# EAGLE design motorboard (EAGLE 6.6.0)

## Sheet 1 of 3
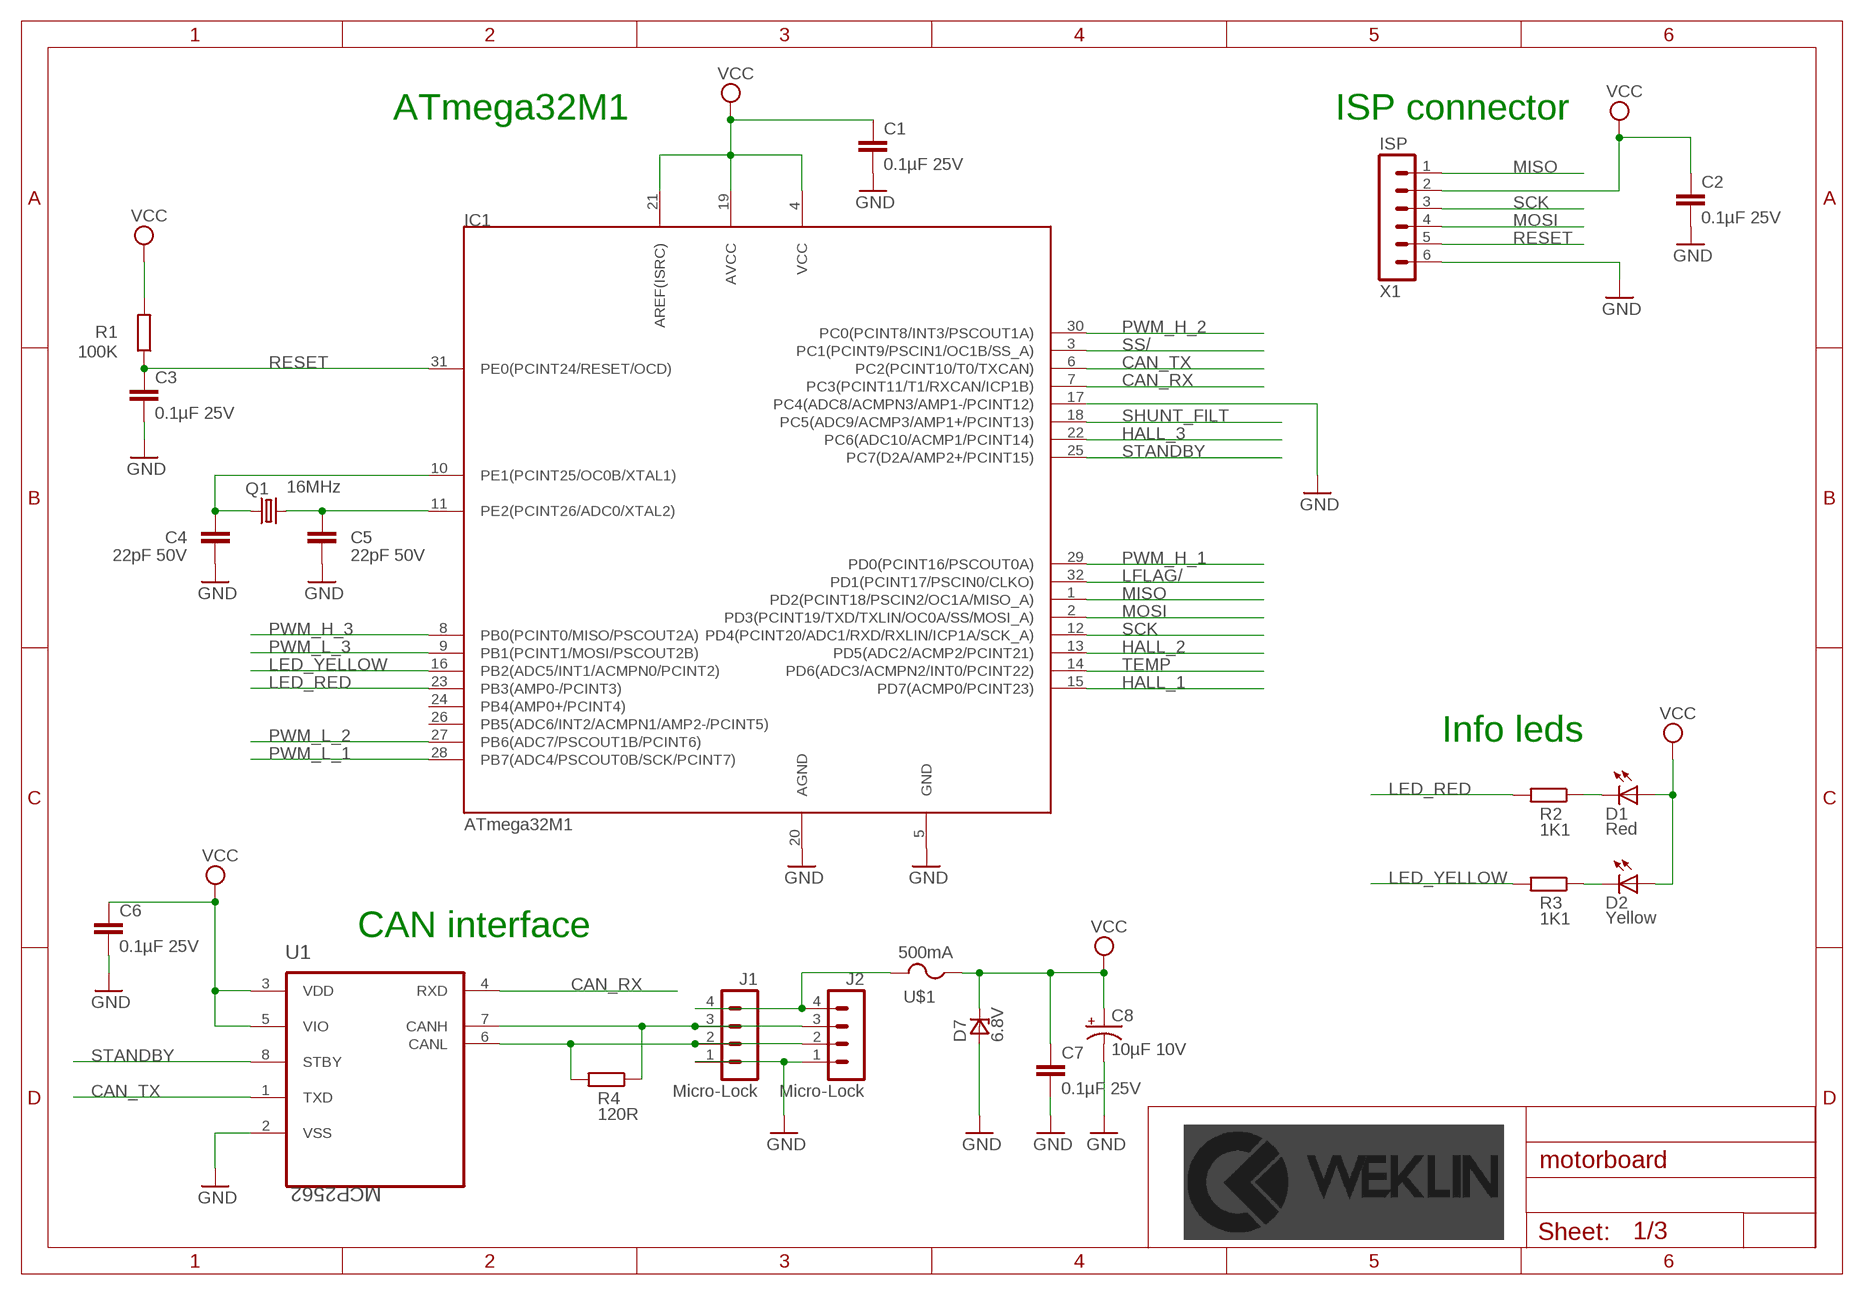
[diagram p0: schematic, sheet 1]

### Parts
C1  0.1µF 25V  CAPACITOR_NON_POL-0.1µF-25V(+-10%)(2012)  [C2012]
C2  0.1µF 25V  CAPACITOR_NON_POL-0.1µF-25V(+-10%)(2012)  [C2012]
C3  0.1µF 25V  CAPACITOR_NON_POL-0.1µF-25V(+-10%)(2012)  [C2012]
C4  22pF 50V  CAPACITOR_NON_POL-22PF-50V(+-5%)(2012)  [C2012]
C5  22pF 50V  CAPACITOR_NON_POL-22PF-50V(+-5%)(2012)  [C2012]
C6  0.1µF 25V  CAPACITOR_NON_POL-0.1µF-25V(+-10%)(2012)  [C2012]
C7  0.1µF 25V  CAPACITOR_NON_POL-0.1µF-25V(+-10%)(2012)  [C2012]
C8  10µF 10V  CAPACITOR_POL-10µF-10V(+-10%)(3216)  [EIA3216]
D1  Red  LEDVLDS1235G  [VLD]
D2  Yellow  LED-VLDY1235G  [VLD]
D7  6.8V  ZENER_UNIDIR6.8  [DO-214AA]
IC1  ATmega32M1  ATMEGA32M1-TQFP32  [TQFP32]
J1  Micro-Lock  MICROLOCK-4CMS  [504195-0470]
J2  Micro-Lock  MICROLOCK-4CMS  [504195-0470]
Q1  16MHz  CRYSTAL-16MHZ_SMD(3225)  [SMD_KX7]
R1  100K  RESISTOR-100K(+-1%)(2012)  [R2012]
R2  1K1  RESISTOR-1K1(+-1%)(2012)  [R2012]
R3  1K1  RESISTOR-1K1(+-1%)(2012)  [R2012]
R4  120R  RESISTOR-120R(+-1%)(2012)  [R2012]
U1  MCP2562  MCP2562-E/SN-SOIC8  [SOIC8]
U$1  500mA  FUSE  [EIARS-481-2]
X1  ISP  MINITEK_127_6WAYS-SMD  [MINITEK_127_6WAY_SMD]

### Nets
CAN_RX: IC1.7(PC3(PCINT11/T1/RXCAN/ICP1B)) U1.4(RXD)
CAN_TX: IC1.6(PC2(PCINT10/T0/TXCAN)) U1.1(TXD)
GND: C1.2 C2.2 C3.2 C4.2 C5.2 C6.2 C7.2 C8.C(-) D7.A IC1.5(GND) IC1.17(PC4(ADC8/ACMPN3/AMP1-/PCINT12)) IC1.20(AGND) J1.1 J2.1 U1.2(VSS) X1.6 ; also sheet 2,3
HALL_1: IC1.15(PD7(ACMP0/PCINT23)) ; also sheet 2
HALL_2: IC1.13(PD5(ADC2/ACMP2/PCINT21)) ; also sheet 2
HALL_3: IC1.22(PC6(ADC10/ACMP1/PCINT14)) ; also sheet 2
LED_RED: IC1.23(PB3(AMP0-/PCINT3)) R2.2
LED_YELLOW: IC1.16(PB2(ADC5/INT1/ACMPN0/PCINT2)) R3.2
LFLAG/: IC1.32(PD1(PCINT17/PSCIN0/CLKO)) ; also sheet 2
MISO: IC1.1(PD2(PCINT18/PSCIN2/OC1A/MISO_A)) X1.1 ; also sheet 2
MOSI: IC1.2(PD3(PCINT19/TXD/TXLIN/OC0A/SS/MOSI_A)) X1.4 ; also sheet 2
N$2: D1.C R2.1
N$3: D2.C R3.1
N$4: J1.4 J2.4 U$1.2
N$5: J1.2 J2.2 R4.2 U1.6(CANL)
N$6: J1.3 J2.3 R4.1 U1.7(CANH)
N$7: C5.1 IC1.11(PE2(PCINT26/ADC0/XTAL2)) Q1.3
N$9: C4.1 IC1.10(PE1(PCINT25/OC0B/XTAL1)) Q1.1
PWM_H_1: IC1.29(PD0(PCINT16/PSCOUT0A)) ; also sheet 3
PWM_H_2: IC1.30(PC0(PCINT8/INT3/PSCOUT1A)) ; also sheet 3
PWM_H_3: IC1.8(PB0(PCINT0/MISO/PSCOUT2A)) ; also sheet 3
PWM_L_1: IC1.28(PB7(ADC4/PSCOUT0B/SCK/PCINT7)) ; also sheet 3
PWM_L_2: IC1.27(PB6(ADC7/PSCOUT1B/PCINT6)) ; also sheet 3
PWM_L_3: IC1.9(PB1(PCINT1/MOSI/PSCOUT2B)) ; also sheet 3
RESET: C3.1 IC1.31(PE0(PCINT24/RESET/OCD)) R1.1 X1.5
SCK: IC1.12(PD4(PCINT20/ADC1/RXD/RXLIN/ICP1A/SCK_A)) X1.3 ; also sheet 2
SHUNT_FILT: IC1.18(PC5(ADC9/ACMP3/AMP1+/PCINT13)) ; also sheet 2
SS/: IC1.3(PC1(PCINT9/PSCIN1/OC1B/SS_A)) ; also sheet 2
STANDBY: IC1.25(PC7(D2A/AMP2+/PCINT15)) U1.8(STBY) ; also sheet 2
TEMP: IC1.14(PD6(ADC3/ACMPN2/INT0/PCINT22)) ; also sheet 2
VCC: C1.1 C2.1 C6.1 C7.1 C8.A(+) D1.A D2.A D7.C IC1.4(VCC) IC1.19(AVCC) IC1.21(AREF(ISRC)) R1.2 U1.3(VDD) U1.5(VIO) U$1.1 X1.2 ; also sheet 2
Unconnected: IC1.24(PB4(AMP0+/PCINT4)) IC1.26(PB5(ADC6/INT2/ACMPN1/AMP2-/PCINT5))

### Notes on the sheet
- ATmega32M1 | ISP connector
- Info leds
- CAN interface

## Sheet 2 of 3
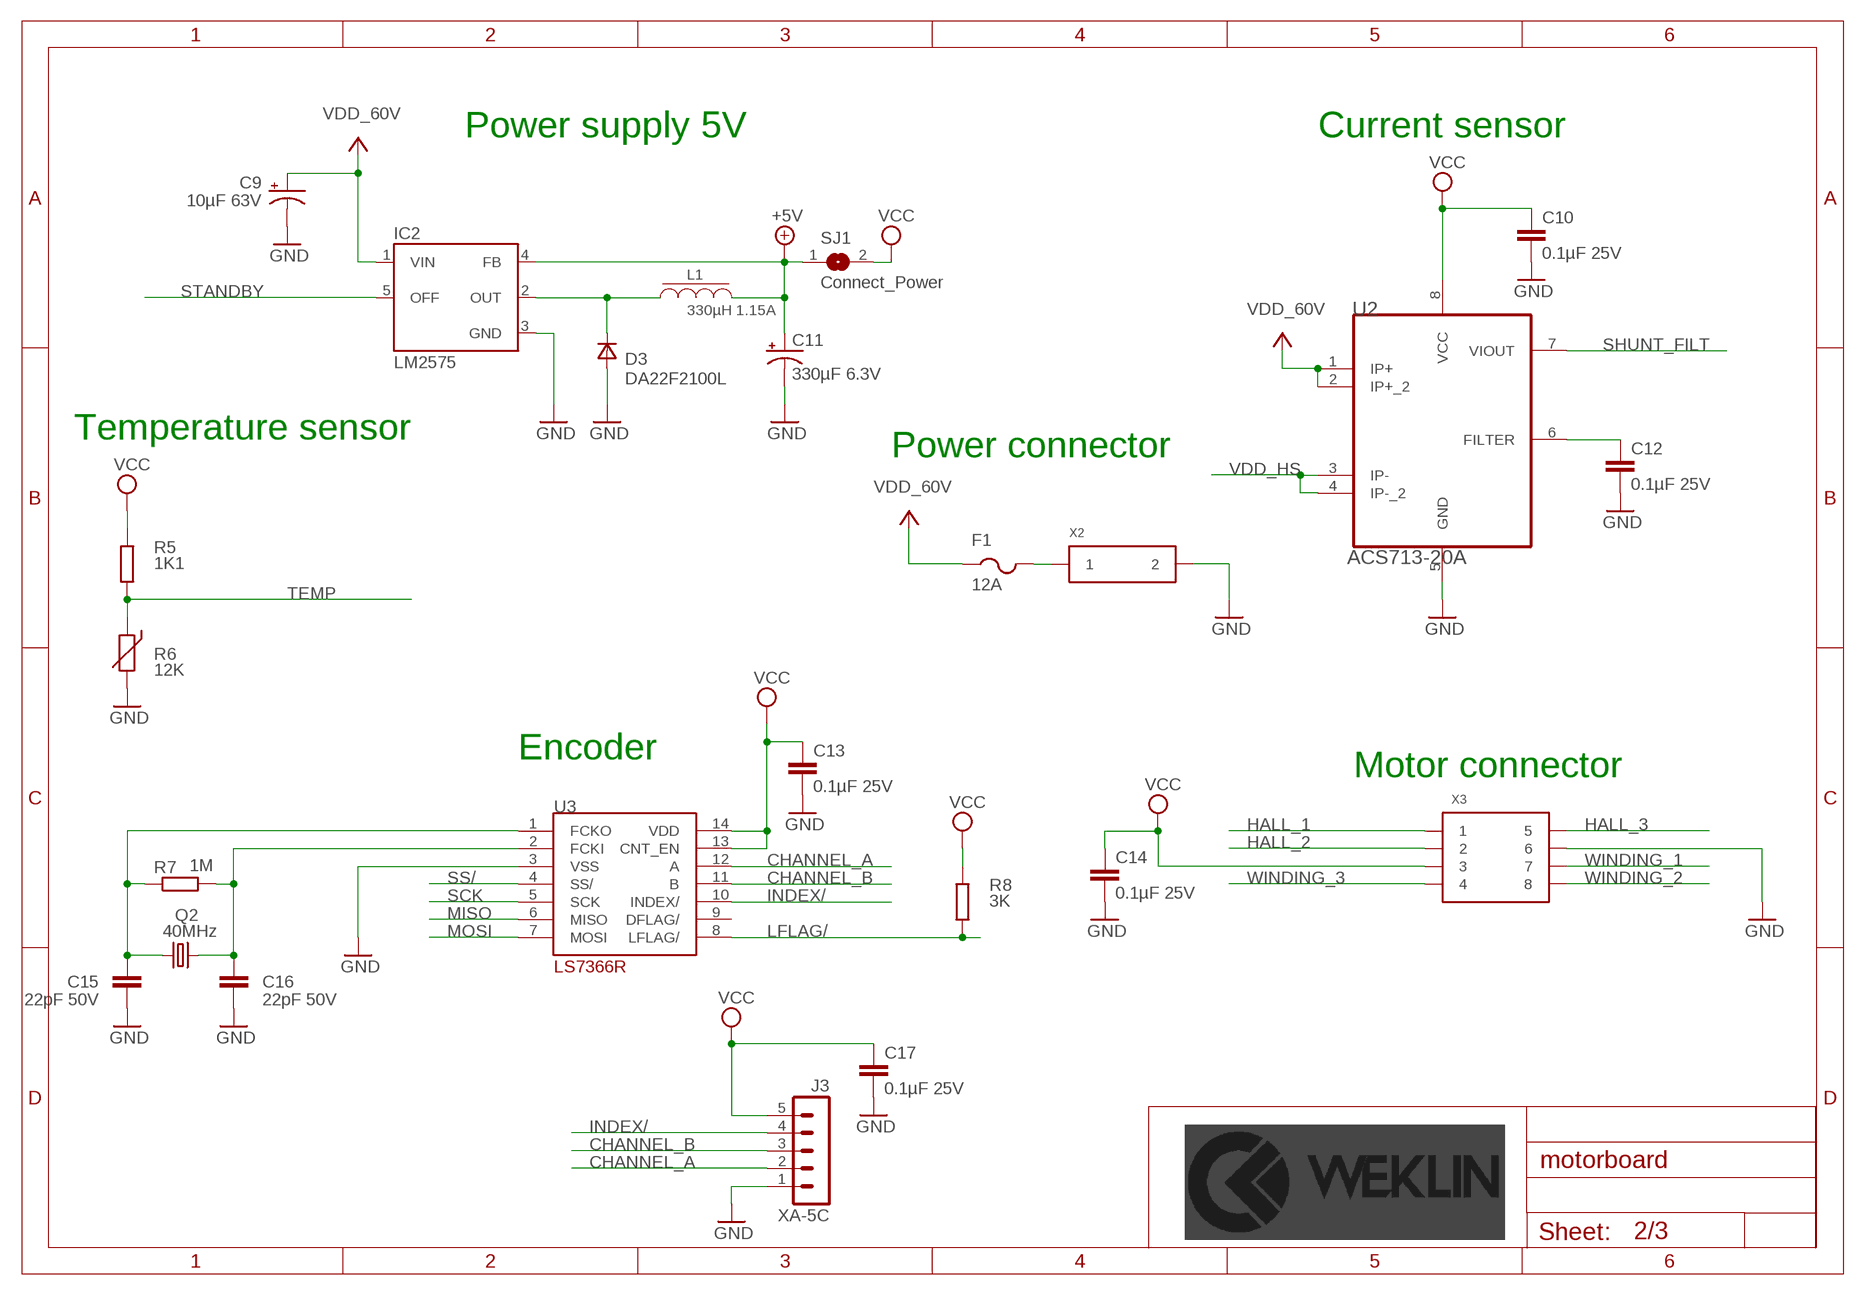
[diagram p1: schematic, sheet 2]

### Parts
C9  10µF 63V  CAPACITOR_POL-100µF-63V(+-10%)(1010)  [153CLV-1010]
C10  0.1µF 25V  CAPACITOR_NON_POL-0.1µF-25V(+-10%)(2012)  [C2012]
C11  330µF 6.3V  CAPACITOR_POL-330µF-6.3V(+-10%)(7343)  [EIA7343]
C12  0.1µF 25V  CAPACITOR_NON_POL-0.1µF-25V(+-10%)(2012)  [C2012]
C13  0.1µF 25V  CAPACITOR_NON_POL-0.1µF-25V(+-10%)(2012)  [C2012]
C14  0.1µF 25V  CAPACITOR_NON_POL-0.1µF-25V(+-10%)(2012)  [C2012]
C15  22pF 50V  CAPACITOR_NON_POL-22PF-50V(+-5%)(2012)  [C2012]
C16  22pF 50V  CAPACITOR_NON_POL-22PF-50V(+-5%)(2012)  [C2012]
C17  0.1µF 25V  CAPACITOR_NON_POL-0.1µF-25V(+-10%)(2012)  [C2012]
D3  DA22F2100L  DIODE-DA22F2100L  [SOD323]
F1  12A  PTCFUSE-3216(1206)  [R3216]
IC2  LM2575  LM2575-TO263  [TO263-5]
J3  XA-5C  XA-5-RIGHT_ANGLE  [S05B-XASK-1]
L1  330µH 1.15A  SRR1260A-331K  [DRA124]
Q2  40MHz  CRYSTAL-40MHZ_SMD(3225)  [SMD_KX7]
R5  1K1  RESISTOR-1K1(+-1%)(2012)  [R2012]
R6  12K  NB12L00123KBB-2012(0805)  [T2012]
R7  1M  RESISTOR-1M(+-1%)(2012)  [R2012]
R8  3K  RESISTOR-3K(+-1%)(2012)  [R2012]
SJ1  Connect_Power  JUMPER_PCB  [SJ]
U2  ACS713-20A  ASC713713ELCTR-20A-T  [SOIC8]
U3  LS7366R  LS7366R-TS-TSSOP14  [TSSOP14]
X2  Mini-Fit  MINI-FIT-JR-025569-NA1  [5569-02]
X3  Mini-Fit  MINI-FIT-JR-085569-NA1  [5569-08]

### Nets
+5V: C11.A(+) IC2.4(FB) L1.2 SJ1.1 ; also sheet 3
CHANNEL_A: J3.2 U3.12(A)
CHANNEL_B: J3.3 U3.11(B)
GND: C9.- C10.2 C11.C(-) C12.2 C13.2 C14.2 C15.2 C16.2 C17.2 D3.2(A) IC2.3(GND) J3.1 R6.2 U2.5(GND) U3.3(VSS) X2.P2 X3.P6 ; also sheet 1,3
HALL_1: X3.P1 ; also sheet 1
HALL_2: X3.P2 ; also sheet 1
HALL_3: X3.P5 ; also sheet 1
INDEX/: J3.4 U3.10(INDEX/)
LFLAG/: R8.2 U3.8(LFLAG/) ; also sheet 1
MISO: U3.6(MISO) ; also sheet 1
MOSI: U3.7(MOSI) ; also sheet 1
N$1: D3.1(C) IC2.2(OUT) L1.1
N$11: C16.1 Q2.3 R7.2 U3.2(FCKI)
N$14: C15.1 Q2.1 R7.1 U3.1(FCKO)
N$15: F1.2 X2.P1
N$16: C12.1 U2.6(FILTER)
SCK: U3.5(SCK) ; also sheet 1
SHUNT_FILT: U2.7(VIOUT) ; also sheet 1
SS/: U3.4(SS/) ; also sheet 1
STANDBY: IC2.5(OFF) ; also sheet 1
TEMP: R5.1 R6.1 ; also sheet 1
VCC: C10.1 C13.1 C14.1 C17.1 J3.5 R5.2 R8.1 SJ1.2 U2.8(VCC) U3.13(CNT_EN) U3.14(VDD) X3.P3 ; also sheet 1
VDD: C9.+ F1.1 IC2.1(VIN) U2.1(IP+) U2.2(IP+_2) ; supply symbol labelled VDD_60V
VDD_HS: U2.3(IP-) U2.4(IP-_2) ; also sheet 3
WINDING_1: X3.P7 ; also sheet 3
WINDING_2: X3.P8 ; also sheet 3
WINDING_3: X3.P4 ; also sheet 3
Unconnected: U3.9(DFLAG/)

### Notes on the sheet
- Power supply 5V | Current sensor
- Temperature sensor
- Power connector
- Encoder
- Motor connector

## Sheet 3 of 3
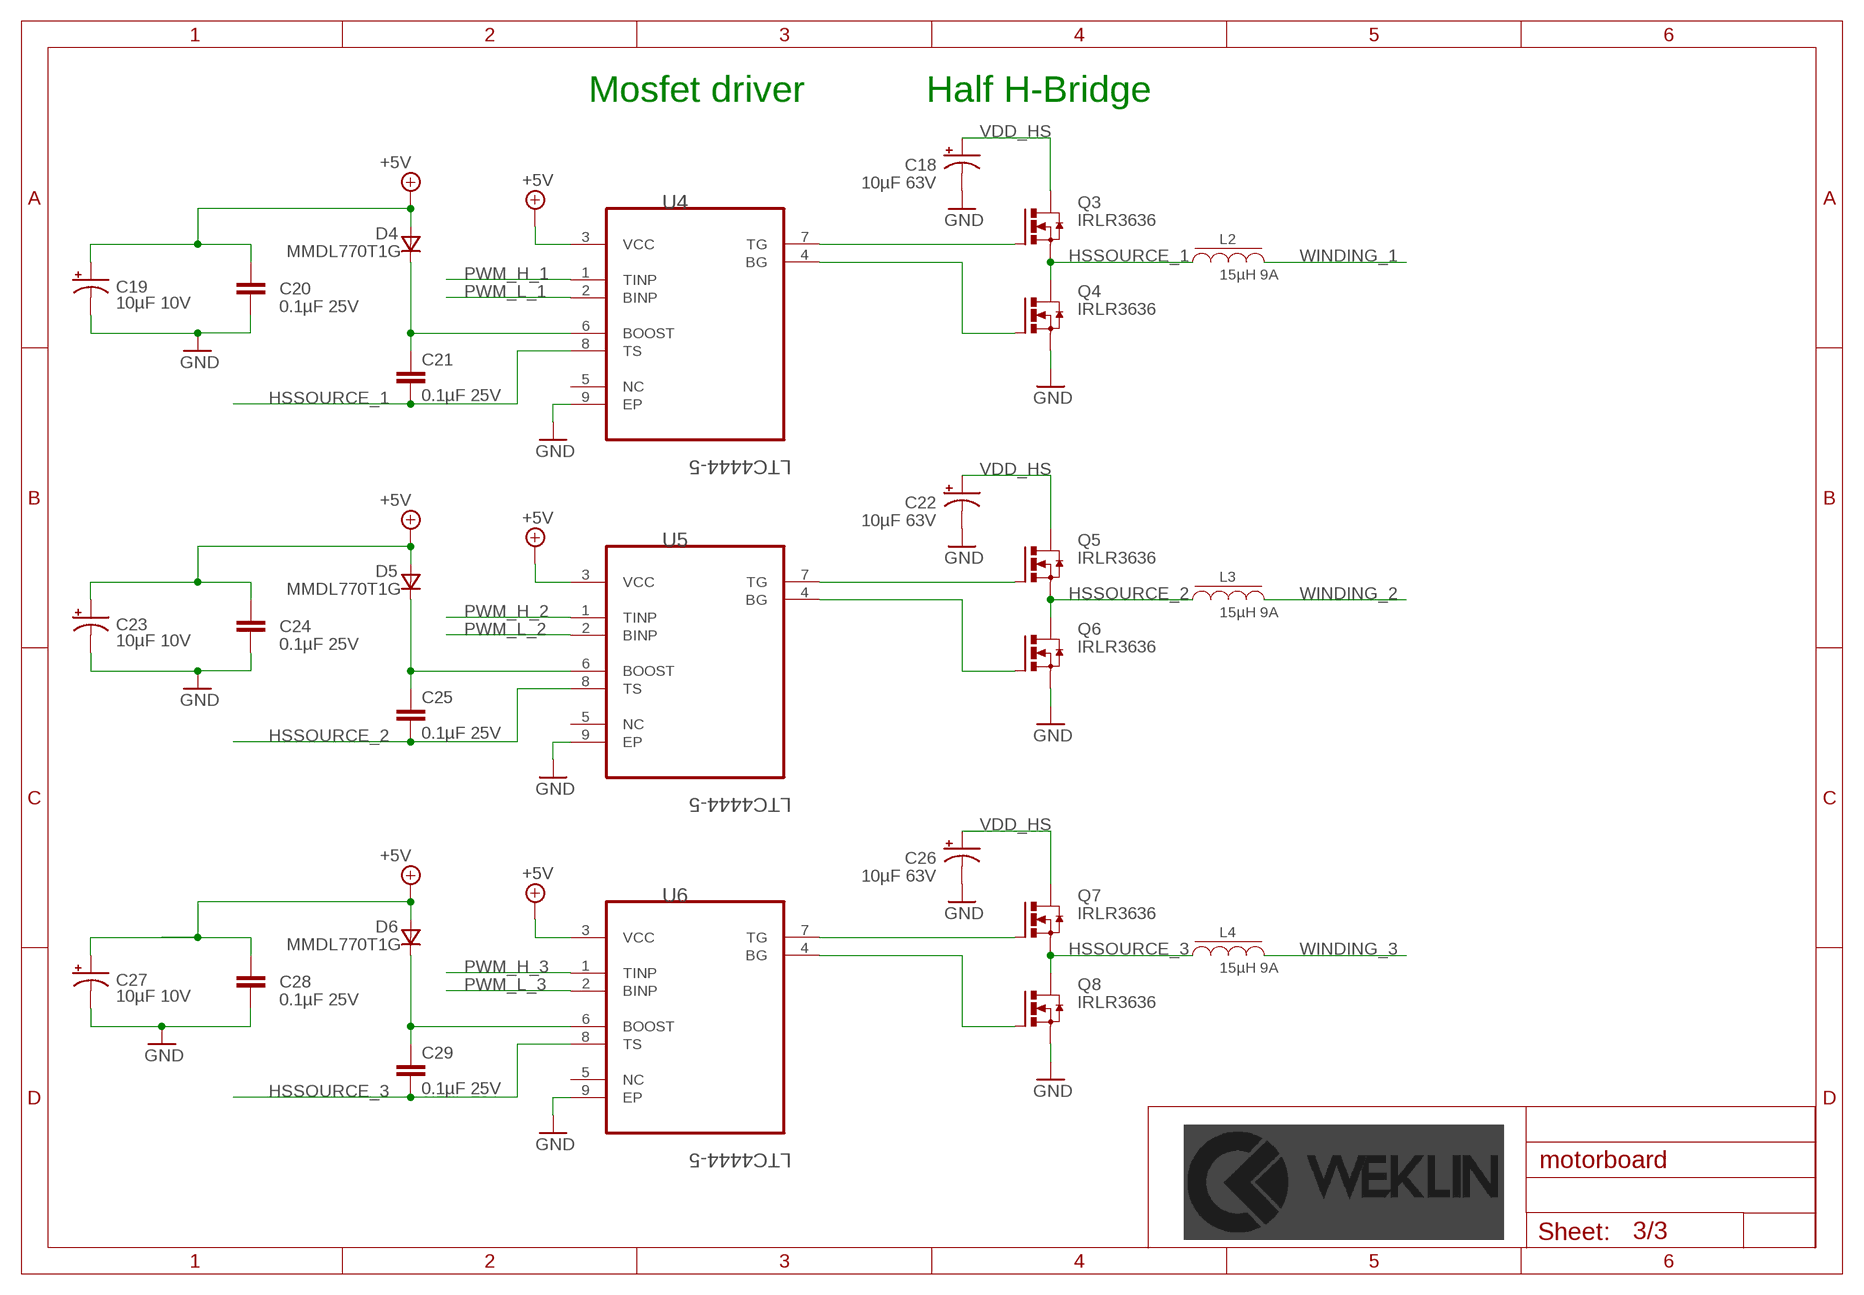
[diagram p2: schematic, sheet 3]

### Parts
C18  10µF 63V  CAPACITOR_POL-100µF-63V(+-10%)(1010)  [153CLV-1010]
C19  10µF 10V  CAPACITOR_POL-10µF-10V(+-10%)(3216)  [EIA3216]
C20  0.1µF 25V  CAPACITOR_NON_POL-0.1µF-25V(+-10%)(2012)  [C2012]
C21  0.1µF 25V  CAPACITOR_NON_POL-0.1µF-25V(+-10%)(2012)  [C2012]
C22  10µF 63V  CAPACITOR_POL-100µF-63V(+-10%)(1010)  [153CLV-1010]
C23  10µF 10V  CAPACITOR_POL-10µF-10V(+-10%)(3216)  [EIA3216]
C24  0.1µF 25V  CAPACITOR_NON_POL-0.1µF-25V(+-10%)(2012)  [C2012]
C25  0.1µF 25V  CAPACITOR_NON_POL-0.1µF-25V(+-10%)(2012)  [C2012]
C26  10µF 63V  CAPACITOR_POL-100µF-63V(+-10%)(1010)  [153CLV-1010]
C27  10µF 10V  CAPACITOR_POL-10µF-10V(+-10%)(3216)  [EIA3216]
C28  0.1µF 25V  CAPACITOR_NON_POL-0.1µF-25V(+-10%)(2012)  [C2012]
C29  0.1µF 25V  CAPACITOR_NON_POL-0.1µF-25V(+-10%)(2012)  [C2012]
D4  MMDL770T1G  DIODE-MMDL770T1G  [SOD323]
D5  MMDL770T1G  DIODE-MMDL770T1G  [SOD323]
D6  MMDL770T1G  DIODE-MMDL770T1G  [SOD323]
L2  15µH 9A  SRP1265A-150M  [DRA127]
L3  15µH 9A  SRP1265A-150M  [DRA127]
L4  15µH 9A  SRP1265A-150M  [DRA127]
Q3  IRLR3636  [TO252]
Q4  IRLR3636  [TO252]
Q5  IRLR3636  [TO252]
Q6  IRLR3636  [TO252]
Q7  IRLR3636  [TO252]
Q8  IRLR3636  [TO252]
U4  LTC4444-5  LTC4444EMS8EPBF  [MSOP8]
U5  LTC4444-5  LTC4444EMS8EPBF  [MSOP8]
U6  LTC4444-5  LTC4444EMS8EPBF  [MSOP8]

### Nets
+5V: C19.A(+) C20.1 C23.A(+) C24.1 C27.A(+) C28.1 D4.2(A) D5.2(A) D6.2(A) U4.3(VCC) U5.3(VCC) U6.3(VCC) ; also sheet 2
GND: C18.- C19.C(-) C20.2 C22.- C23.C(-) C24.2 C26.- C27.C(-) C28.2 Q4.3(S) Q6.3(S) Q8.3(S) U4.9(EP) U5.9(EP) U6.9(EP) ; also sheet 1,2
HSSOURCE_1: C21.2 L2.1 Q3.3(S) Q4.4(D) U4.8(TS)
HSSOURCE_2: C25.2 L3.1 Q5.3(S) Q6.4(D) U5.8(TS)
HSSOURCE_3: C29.2 L4.1 Q7.3(S) Q8.4(D) U6.8(TS)
N$8: C25.1 D5.1(C) U5.6(BOOST)
N$10: C21.1 D4.1(C) U4.6(BOOST)
N$12: Q4.1(G) U4.4(BG)
N$13: Q3.1(G) U4.7(TG)
N$17: Q6.1(G) U5.4(BG)
N$18: Q5.1(G) U5.7(TG)
N$20: C29.1 D6.1(C) U6.6(BOOST)
N$21: Q8.1(G) U6.4(BG)
N$22: Q7.1(G) U6.7(TG)
PWM_H_1: U4.1(TINP) ; also sheet 1
PWM_H_2: U5.1(TINP) ; also sheet 1
PWM_H_3: U6.1(TINP) ; also sheet 1
PWM_L_1: U4.2(BINP) ; also sheet 1
PWM_L_2: U5.2(BINP) ; also sheet 1
PWM_L_3: U6.2(BINP) ; also sheet 1
VDD_HS: C18.+ C22.+ C26.+ Q3.4(D) Q5.4(D) Q7.4(D) ; also sheet 2
WINDING_1: L2.2 ; also sheet 2
WINDING_2: L3.2 ; also sheet 2
WINDING_3: L4.2 ; also sheet 2
Unconnected: U4.5(NC) U5.5(NC) U6.5(NC)

### Notes on the sheet
- Mosfet driver | Half H-Bridge

## Library data of the parts
C1-C3 C6 C7 C10 C12-C14 C17 C20 C21 C24 C25 C28 C29 = weklin_capacitor:CAPACITOR_NON_POL: Condensateur céramique multicouche; LIB: weklin_capacitor; MANUFACTURER: AVX; MPN: 08053C104KAT2A; OC_FARNELL: 2280951; PRICE: 0,0036
C4 C5 C15 C16 = weklin_capacitor:CAPACITOR_NON_POL: Condensateur céramique multicouche; LIB: weklin_capacitor; MANUFACTURER: Multicomp; MPN: MC0805N220J500CT; OC_FARNELL: 2310684; PRICE: 0,0078
C8 C19 C23 C27 = weklin_capacitor:CAPACITOR_POL: Capacitor; LIB: weklin_capacitor; MANUFACTURER: Kemet; MPN: T491A106K010AT; OC_FARNELL: 2250086; PRICE: 0,0578
C9 C18 C22 C26 = weklin_capacitor:CAPACITOR_POL: Capacitor; LIB: weklin_capacitor; MANUFACTURER: Nichicon; MPN: UUX1J101MNL1GS; OC_FARNELL: 1898746; PRICE: 0,45
C11 = weklin_capacitor:CAPACITOR_POL: Capacitor; LIB: weklin_capacitor; MANUFACTURER: Kemet; MPN: T491D337K006AT; OC_FARNELL: 2313928; PRICE: 0,497
D1 = weklin_led:LED: Led; LIB: weklin_led; MANUFACTURER: Vishay; MPN: VLDS1235G; OC_FARNELL: 2494682; PRICE: 0,003
D2 = weklin_led:LED: Led; LIB: weklin_led; MANUFACTURER: Vishay; MPN: VLDY1235G; OC_FARNELL: 2494684; PRICE: 0,003
D3 = weklin_diode:DIODE: Diode; LIB: weklin_diode; MPN: DA22F2100L; OC_FARNELL: 2459014; PRICE: 0,29
D4-D6 = weklin_diode:DIODE: Diode; LIB: weklin_diode; MPN: MMDL770T1G; OC_FARNELL: 2317690; PRICE: 0,034
D7 = weklin_diode:ZENER_UNIDIR: P6SMBxxA Series of unidirectional Transient Voltage Suppressor Diodes xx = Stand-off Voltage VR in Volts; PPmax = 600 W Case: SMB = DO 214 AA Note: Footprint acc. to ST specs; source: www.st.com Author: Dipl.-Ing. FH Rainer Bayer, www.ing-rb.de/hhn Feedback: rainer.bayer@hs-heilbronn.de; LIB: weklin_diode; MANUFACTURER: ON Semiconductor; MPN: P6SMB6.8AT3G; OC_FARNELL: 1459166RL; PRICE: 0,178
F1 = weklin_fuse:PTCFUSE: Fuse time lag; LIB: weklin_fuse; MPN: 3413.0329.22; OC_FARNELL: 1829472; PRICE: 0,973
IC1 = weklin_micro-atmell:ATMEGA32M1: ATMEL ATMEGA32M1-AU MCU 8 BITS ATMEGA 16MHZ; LIB: weklin_micro_atmell; MANUFACTURER: Atmel; MPN: ATmega32M1-AU; OC_FARNELL: 2443180; PRICE: 6,18
IC2 = weklin_regulator:LM2575: SIMPLE SWITCHER 1A Step-Down Voltage Regulator; LIB: weklin_regulator; MPN: LM2575HVS-5.0/NOPB; OC_FARNELL: 1469170; PRICE: 5,04
J1 J2 = weklin_micro-lock:MICROLOCK-4: Connecteur MOLEX de 4 Contacts Série Mini50 GEII/IUT ANGERS; LIB: weklin_micro-lock; MANUFACTURER: Molex; MPN: 504195-0470; OC_FARNELL: 2445490; PRICE: 0,713
J3 = weklin_xa:XA-5: Connector JST XA 5 way; LIB: weklin_xa; MPN: S05B-XASK-1(LF)(SN); OC_FARNELL: 9492160; PRICE: 0,546
L1 = weklin_inductor:SRR1260A-331K: Power inductor 330µH 1.15A; LIB: weklin_inductor; MPN: SRR1260A-331K; OC_FARNELL: 2374141; PRICE: 1,04
L2-L4 = weklin_inductor:SRP1265A-150M: Power inductor 15µH 9A; LIB: weklin_inductor; MPN: SRP1265A-150M; OC_FARNELL: 2434073; PRICE: 1,20
Q1 = weklin_crystal:CRYSTAL: Crystal resonator; LIB: weklin_crystal; MANUFACTURER: AEL CRYSTALS; MPN: E3SB16.0000F09G11AE; OC_FARNELL: 2467444RL; PRICE: 0,315
Q2 = weklin_crystal:CRYSTAL: Crystal resonator; LIB: weklin_crystal; MANUFACTURER: Epson; MPN: X1E0000210488 TSX-3225; OC_FARNELL: 2471834; PRICE: 0,636
Q3-Q8 = weklin_mosfet:IRLR3636: Transistor MOSFET, Canal N; LIB: weklin_mosfet; MANUFACTURER: International Rectifier; MPN: IRLR3636PbF; OC_FARNELL: 1698302; PRICE: 1,89
R1 = weklin_resistor:RESISTOR: Resistor; LIB: weklin_resistor; MANUFACTURER: Multicomp; MPN: MCWR08X1003FTL; OC_FARNELL: 2446868; PRICE: 0,0014
R2 R3 R5 = weklin_resistor:RESISTOR: Resistor; LIB: weklin_resistor; MANUFACTURER: Multicomp; MPN: MC0805S8F1101T5E; OC_FARNELL: 1635316; PRICE: 0,003
R4 = weklin_resistor:RESISTOR: Resistor; LIB: weklin_resistor; MANUFACTURER: Multicomp; MPN: MCWR08X1200FTL; OC_FARNELL: 2446878; PRICE: 0,0014
R6 = weklin_thermistor:NB12L00123KBB: Thermistor; LIB: weklin_thermistor; MPN: NB12L00123KBB; OC_FARNELL: 1672292; PRICE: 0,14
R7 = weklin_resistor:RESISTOR: Resistor; LIB: weklin_resistor; MPN: MCWR08X1004FTL; OC_FARNELL: 2446913; PRICE: 0,0014
R8 = weklin_resistor:RESISTOR: Resistor; LIB: weklin_resistor; MPN: MC0805S8F3001T5E; OC_FARNELL: 1635321; PRICE: 0,003
SJ1 = weklin_jumper:JUMPER_PCB: SMD solder JUMPER; LIB: weklin_jumper; MPN: N.A.; OC_FARNELL: N.A.; PRICE: 0
U1 = weklin_ic_can:MCP2562-E/SN: High-Speed CAN Transceiver; LIB: weklin_ic_can; MANUFACTURER: Microchip; MPN: MCP2562-E/SN; OC_FARNELL: 2362839; PRICE: 1,12
U2 = weklin_sensor:ASC713: Linear Current Sensor; LIB: weklin_sensor; MPN: ACS713ELCTR-20A-T; OC_FARNELL: 1651976; PRICE: 4,44
U3 = weklin_ic_special:LS7366R-TS: 32-bits quadrature counter IC with SPI; LIB: weklin_ic_special; MPN: LS7366R-TS; OC_FARNELL: N.A.; PRICE: 5
U4-U6 = weklin_mosfet_driver:LTC4444EMS8EPBF: High Voltage Synchronous N-Channel MOSFET Driver; LIB: weklin_mosfet_driver; MPN: LTC4444EMS8E-5#PBF; OC_FARNELL: 1628762; PRICE: 4,17
U$1 = weklin_fuse:FUSE: Fuse 500mA 125V ultra fast; LIB: weklin_fuse; MANUFACTURER: Littlefuse; MPN: 0451.500MRL; OC_FARNELL: 2383271; PRICE: 0,527
X1 = weklin_connector:MINITEK_127_6WAYS: Board-To-Board Connector, Micro-MaTch Series, Embase, 6voies.; LIB: weklin_connector; MANUFACTURER: Minitek; MPN: 20021121-00006C4LF; OC_FARNELL: 1865277; PRICE: 0,333
X2 = weklin_mini-fit:MINI-FIT-JR-02: Mini-Fit Jr connector 2 way; LIB: weklin_mini-fit; MANUFACTURER: Molex; MPN: 39-29-1028; OC_FARNELL: 1012166; PRICE: 0,506
X3 = weklin_mini-fit:MINI-FIT-JR-08: Mini-Fit Jr connector 2 way; LIB: weklin_mini-fit; MANUFACTURER: MOLEX; MPN: 39-29-1088; OC_FARNELL: 9732160; PRICE: 1,27

## Board
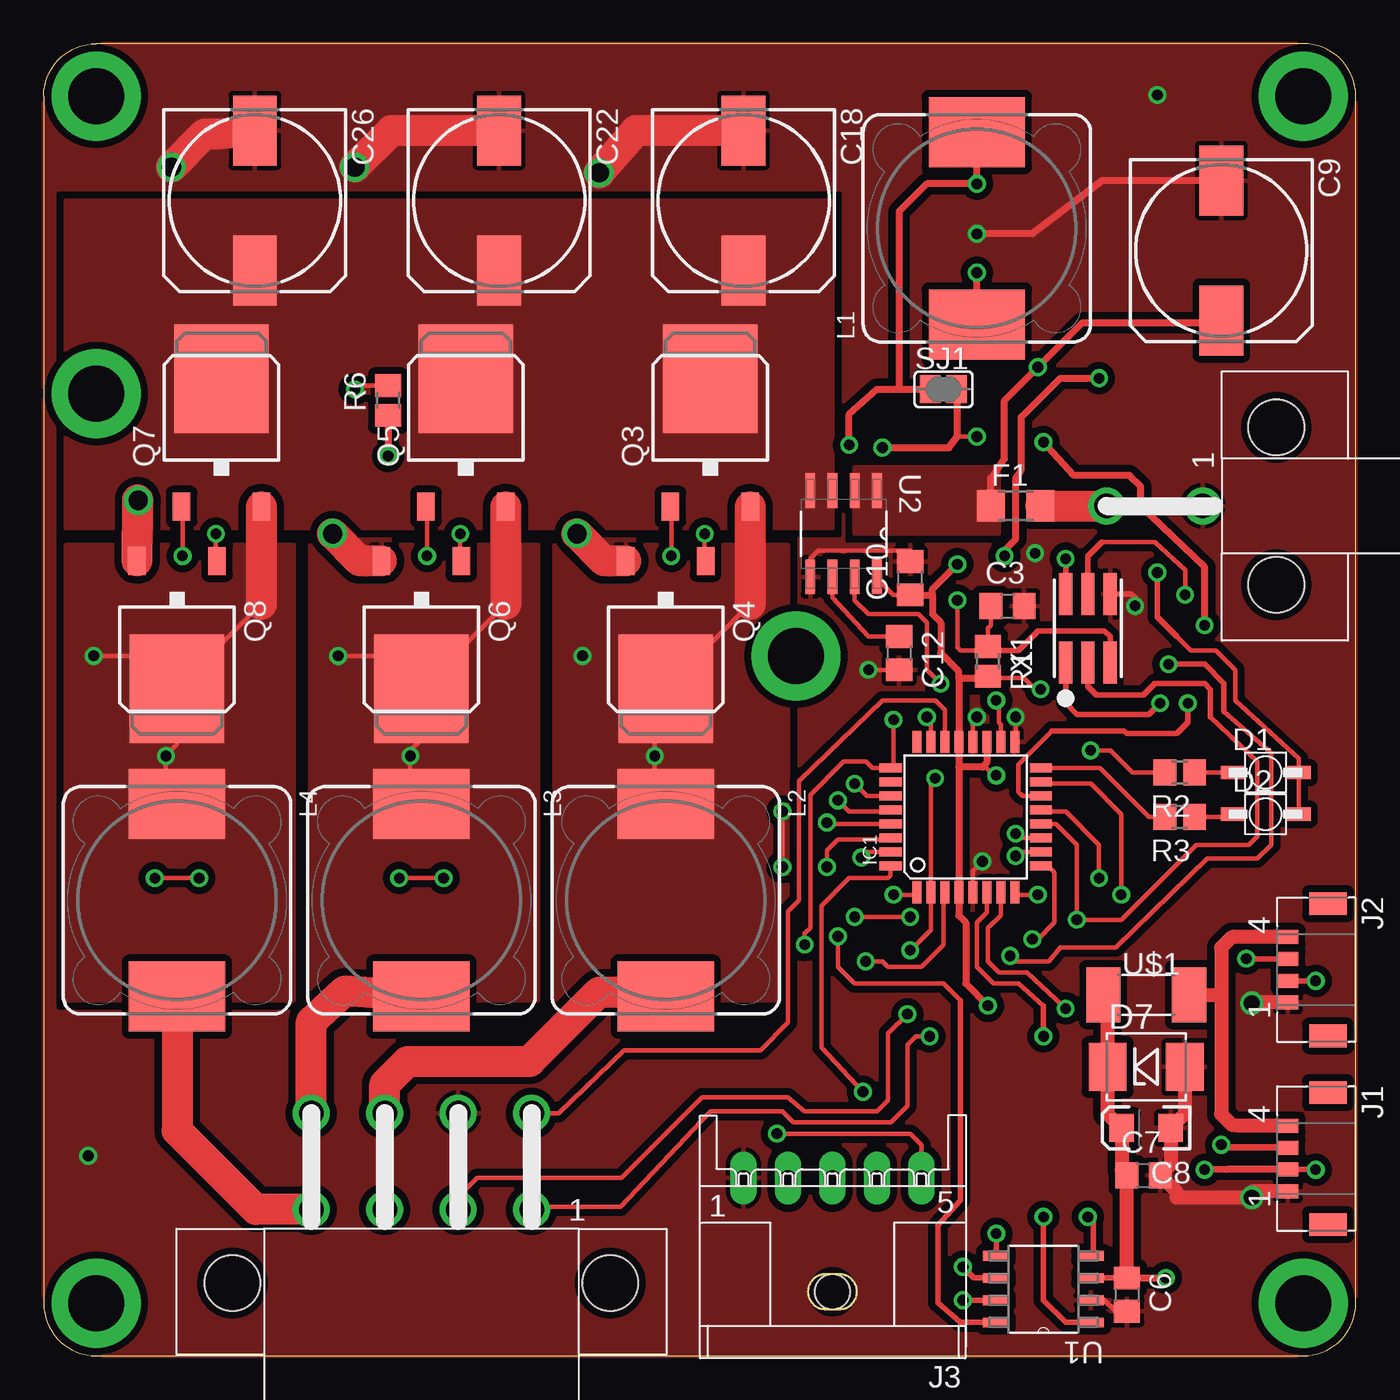
[diagram p3: board, top side]
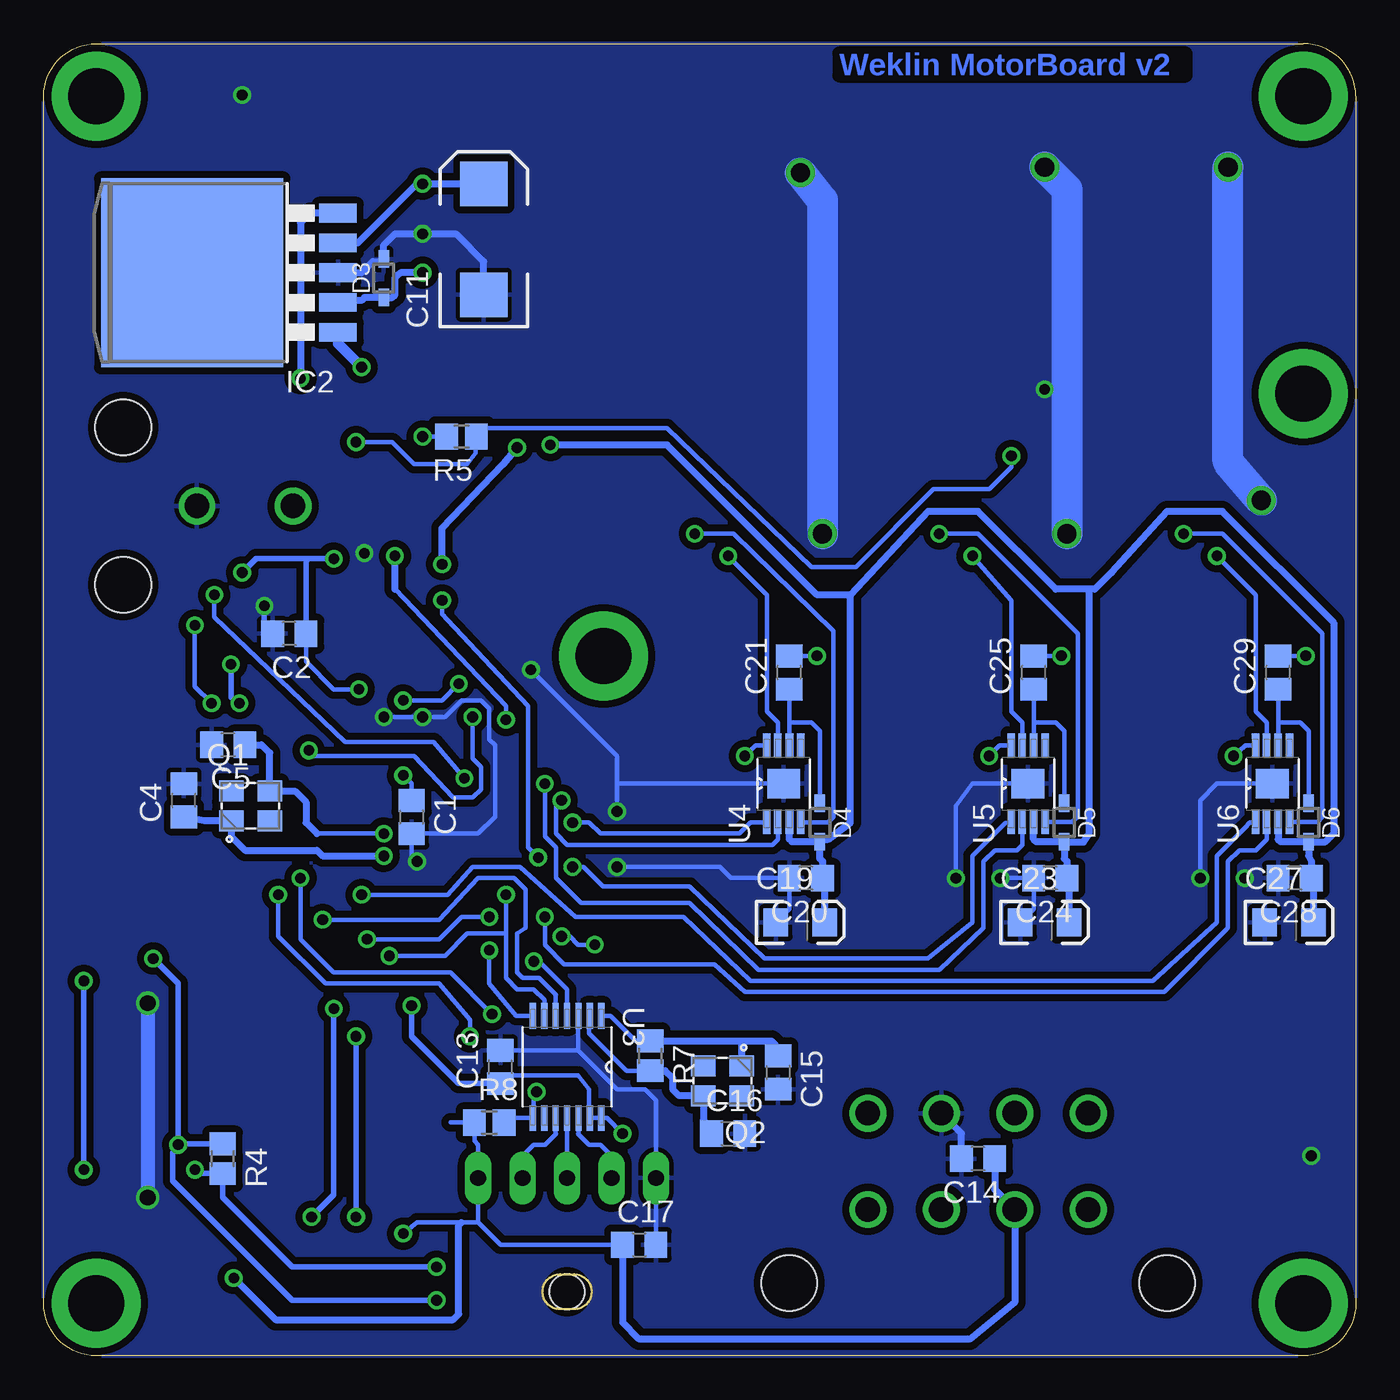
[diagram p4: board, bottom side, seen from below]

Size 75 x 75 mm. Coordinates in mm from the lower left corner, seen from the top.
Outline: 3,0 72,0 arc90 75,3 75,72 arc90 72,75 3,75 arc90 0,72 0,3 arc90 3,0
Copper layers ((1*2)+(15*16)): Top 0.035mm / dielectric 0.489mm / Route2 0.035mm / dielectric 0.486mm / Route15 0.035mm / dielectric 0.486mm / Bottom 0.035mm
Design rules "default *": minimum track width 10mil, minimum drill 24mil, track to track 8mil, track to pad 8mil, pad to pad 8mil, via to via 8mil, smd to smd 8mil, copper to edge 0mil, drill to drill 8mil, minimum pad ring 10mil, minimum via ring 8mil, stop-mask expansion 4mil, vias tented up to drill 0mil, thermal gap 10mil

### Footprints (pad centres in the part's own frame; a part is rotated, then mirrored left to right if it is on the bottom)
C2012 = smd 1.3 x 1.5: 1 -0.95,0; 2 0.95,0
EIA3216 = smd 1.4 x 1.6: A 1.4,0; C -1.4,0
153CLV-1010 = smd 4 x 2.5: + 4,0; - -4,0
EIA7343 = smd 2.55 x 2.7: A 3.17,0; C -3.17,0
VLD = smd 0.75 x 1.35: A 0,1.9; C 0,-1.9
SOD323 = smd 1 x 0.6: 1 -1.1,0; 2 1.1,0
DO-214AA = smd 2.159 x 2.743: A 2.21,0; C -2.21,0
R3216 = smd 1.6 x 1.803: 1 -1.422,0; 2 1.422,0
TQFP32 = smd 1.27 x 0.508: 1 -4.293,2.8; 2 -4.293,2; 3 -4.293,1.2; 4 -4.293,0.4; 5 -4.293,-0.4; 6 -4.293,-1.2; 7 -4.293,-2; 8 -4.293,-2.8; 17 4.293,-2.8; 18 4.293,-2; 19 4.293,-1.2; 20 4.293,-0.4; 21 4.293,0.4; 22 4.293,1.2; 23 4.293,2; 24 4.293,2.8 | smd 0.508 x 1.27: 9 -2.8,-4.293; 10 -2,-4.293; 11 -1.2,-4.293; 12 -0.4,-4.293; 13 0.4,-4.293; 14 1.2,-4.293; 15 2,-4.293; 16 2.8,-4.293; 25 2.8,4.293; 26 2,4.293; 27 1.2,4.293; 28 0.4,4.293; 29 -0.4,4.293; 30 -1.2,4.293; 31 -2,4.293; 32 -2.8,4.293
TO263-5 = smd 1.067 x 2.159: 1 -3.404,-5.791; 2 -1.702,-5.791; 3 0,-5.791; 4 1.702,-5.791; 5 3.404,-5.791 | smd 10.8 x 10.41: 6 0,2.54
504195-0470 = smd 0.8 x 1.2: 1 1.875,0; 2 0.625,0; 3 -0.625,0; 4 -1.875,0 | smd 1.3 x 2.15: P$5 -3.775,2.295; P$6 3.775,2.295
S05B-XASK-1 = drill 0.9 pad 1.524 long: 1 5.08,-3.81; 2 2.54,-3.81; 3 0,-3.81; 4 -2.54,-3.81; 5 -5.08,-3.81 | hole 2: 0,2.69
DRA124 = smd 4 x 5.5: 1 -5.5,0; 2 5.5,0
DRA127 = smd 4 x 5.5: 1 -5.5,0; 2 5.5,0
SMD_KX7 = smd 1.4 x 1.2: 1 -1.1,-0.85; 2 1.1,-0.85; 3 1.1,0.85; 4 -1.1,0.85
TO252 = smd 1 x 1.6: 1 -2.28,-4.8; 3 2.28,-4.8 | smd 5.4 x 6.2: 4 0,2.5
R2012 = smd 1.3 x 1.5: 1 -0.85,0; 2 0.85,0
T2012 = smd 1.3 x 1.5: 1 -0.85,0; 2 0.85,0
SJ = smd 1.168 x 1.6: 1 -0.762,0; 2 0.762,0
SOIC8 = smd 1.473 x 0.559: 1 -2.718,1.905; 2 -2.718,0.635; 3 -2.718,-0.635; 4 -2.718,-1.905; 5 2.718,-1.905; 6 2.718,-0.635; 7 2.718,0.635; 8 2.718,1.905
SOIC8' = smd 1.981 x 0.559: 1 -2.464,1.905; 2 -2.464,0.635; 3 -2.464,-0.635; 4 -2.464,-1.905; 5 2.464,-1.905; 6 2.464,-0.635; 7 2.464,0.635; 8 2.464,1.905
TSSOP14 = smd 1.473 x 0.356: 1 -2.921,1.956; 2 -2.921,1.295; 3 -2.921,0.66; 4 -2.921,0; 5 -2.921,-0.66; 6 -2.921,-1.295; 7 -2.921,-1.956; 8 2.921,-1.956; 9 2.921,-1.295; 10 2.921,-0.66; 11 2.921,0; 12 2.921,0.66; 13 2.921,1.295; 14 2.921,1.956
MSOP8 = smd 1.397 x 0.432: 1 -2.184,0.965; 2 -2.184,0.33; 3 -2.184,-0.33; 4 -2.184,-0.965; 5 2.184,-0.965; 6 2.184,-0.33; 7 2.184,0.33; 8 2.184,0.965 | smd 1.676 x 1.88: 9 0,0
EIARS-481-2 = smd 1.956 x 3.15: 1 -2.451,0; 2 2.451,0
MINITEK_127_6WAY_SMD = smd 0.76 x 2.4: 1 -1.27,-1.95; 2 -1.27,1.95; 3 0,-1.95; 4 0,1.95; 5 1.27,-1.95; 6 1.27,1.95
5569-02 = drill 1.4: P1 0,2.75; P2 0,-2.75 | hole 3.2: -4.5,-6.95; 4.5,-6.95
5569-08 = drill 1.4: P1 6.3,-2.75; P2 2.1,-2.75; P3 -2.1,-2.75; P4 -6.3,-2.75; P5 6.3,2.75; P6 2.1,2.75; P7 -2.1,2.75; P8 -6.3,2.75 | hole 3.2: -10.8,-6.95; 10.8,-6.95

### Placement (x,y rotation side)
C1  53.98,30.8 270 bottom
C2  60.96,41.27 180 bottom
C3  55.09,42.86 0 top
C4  66.99,31.75 90 bottom
C5  64.45,34.92 180 bottom
C6  61.91,3.49 270 top
C7  62.87,10.32 0 top
C8  63.02,13.02 180 top
C9  67.31,63.18 270 top
C10  49.53,44.45 90 top
C11  49.85,63.82 90 bottom
C12  48.9,40.16 270 top
C13  48.9,16.51 90 bottom
C14  21.59,11.27 180 bottom
C15  33.02,16.19 270 bottom
C16  35.88,12.7 0 bottom
C17  40.96,6.35 0 bottom
C18  40.01,66.04 270 top
C19  31.75,24.77 0 bottom
C20  31.43,27.3 180 bottom
C21  32.38,39.05 90 bottom
C22  26.04,66.04 270 top
C23  17.78,24.77 0 bottom
C24  17.46,27.3 180 bottom
C25  18.41,39.05 90 bottom
C26  12.06,66.04 270 top
C27  3.81,24.77 0 bottom
C28  3.49,27.3 180 bottom
C29  4.45,39.05 90 bottom
D1  69.85,33.34 270 top
D2  69.85,30.96 270 top
D3  55.56,61.59 90 bottom
D4  30.64,30.48 270 bottom
D5  16.67,30.48 270 bottom
D6  2.7,30.48 270 bottom
D7  63.02,16.51 0 top
F1  55.56,48.58 0 top
IC1  52.7,30.8 90 top
IC2  63.98,61.91 90 bottom
J1  71.12,11.27 270 top
J2  71.12,22.07 270 top
J3  45.09,6.35 180 top
L1  53.34,64.45 90 top
L2  35.56,26.04 270 top
L3  21.59,26.04 270 top
L4  7.62,26.04 270 top
Q1  63.18,31.43 0 bottom
Q2  36.2,15.72 180 bottom
Q3  38.1,53.34 0 top
Q4  35.56,40.64 180 top
Q5  24.13,53.34 0 top
Q6  21.59,40.64 180 top
Q7  10.16,53.34 0 top
Q8  7.62,40.64 180 top
R1  53.98,39.69 270 top
R2  64.93,33.34 180 top
R3  64.93,30.8 180 top
R4  64.77,11.27 270 bottom
R5  51.12,52.55 180 bottom
R6  19.68,54.61 90 top
R7  40.32,17.14 270 bottom
R8  49.53,13.34 0 bottom
SJ1  51.44,55.24 0 top
U1  57.15,3.81 180 top
U2  ACS713-20A  [SOIC8']  45.72,46.99 270 top
U3  45.09,16.51 270 bottom
U4  32.7,32.7 90 bottom
U5  18.73,32.7 90 bottom
U6  4.76,32.7 90 bottom
U$1  63.02,20.64 0 top
X1  59.69,41.59 0 top
X2  63.5,48.58 90 top
X3  21.59,11.11 0 top

### Tracks (layer width: path | path; a pad name or v marks a point on that pad's centre or on a via)
+5V  (via drill 0.61)
  Top 0.406: 53.44,69.95 L1.2 v53.34,66.99 50.48,66.99 48.9,65.41 48.9,55.24 | 48.9,55.24 SJ1.1 | v46.04,52.07 46.04,53.82 47.62,55.24 48.9,55.24
  Bottom 0.254: 4.43,29.54 4.45,29.53 | C28.1 2.41,27.17 | 32.24,29.38 32.38,29.53 | 32.38,30.5 U4.3 | C24.1 16.38,27.17 | 30.35,27.17 C20.1 | D4.2 30.8,29.53 | D5.2 16.83,29.37
  Bottom 0.406: U6.3 4.43,29.54 | 4.45,29.53 4.3,29.38 D6.2 | D6.2 2.7,28.57 2.54,28.26 C28.1 | U5.3 18.41,29.53 18.27,29.38 D5.2 16.67,28.42 16.51,28.26 C24.1 | 32.24,29.38 D4.2 30.64,28.42 30.48,28.26 C20.1 | 32.38,29.53 32.38,30.5 | C19.A 30.35,27.17 | C27.A 2.41,27.17 | C23.A 16.38,27.17 | 30.8,29.53 30.16,29.53 28.89,30.48 28.89,43.5 | 16.83,29.37 15.56,29.37 15.24,29.84 15.24,43.81 | 28.89,43.5 24.45,48.26 21.59,48.26 17.14,43.81 15.24,43.81 | D6.2 1.74,29.38 1.27,29.84 1.27,41.91 7.62,48.26 10.79,48.26 13.97,44.77 14.92,43.81 15.24,43.81 | IC2.4 57.04,63.61 53.66,66.99 v53.34,66.99 C11.A | 28.89,43.5 30.8,43.5 39.37,52.07 v46.04,52.07
  Bottom 0.61: C11.A
CAN_RX  (via drill 0.61)
  Top 0.254: 58.26,20 56.2,21.91 54.61,21.91 53.98,22.54 53.98,24.45 54.7,25.18 IC1.7 | 60.01,5.86 U1.4
  Top 0.305: 58.26,20 v58.42,19.84 | 60.01,5.86 60.01,7.62 v59.69,7.94
  Bottom 0.305: v58.42,19.84 58.42,9.21 v59.69,7.94
CAN_TX  (via drill 0.61)
  Top 0.254: 57.15,20 55.72,21.27 54.29,21.27 53.34,22.23 53.34,24.77 53.91,25.33 IC1.6
  Top 0.305: U1.1 58.42,1.91 57.15,3.17 v57.15,7.94 | v57.15,18.26 57.15,20
  Bottom 0.305: v57.15,7.94 v57.15,18.26
CHANNEL_A
  Bottom 0.254: U3.12 44.42,12.72 44.45,12.7 43.81,12.06 43.18,12.06 42.55,11.43 J3.2
CHANNEL_B
  Bottom 0.254: U3.11 J3.3
GND  (via drill 0.61, 0.89, 1.1, 1.1 pad 0.81)
  Top 0.254: v6.35,27.3 v8.89,27.3 | v20.32,27.3 v22.86,27.3 | R6.2 18,55.46 v17.78,55.24 | U1.2 60.64,3.17 | 61.28,2.54 C6.2 | IC1.5 53.1,27.7 v53.66,28.26 | IC1.20 53.1,36.28 v53.34,36.51 | v55.56,36.51 55.56,35.15 IC1.17 | v42.23,27.94 v42.23,31.11 | U2.5 43.81,45.56 44.29,46.04 49.05,46.04 49.53,46.03 C10.2 49.53,46.03 | C12.2 v47.15,39.21
  Top 0.305: 60.64,3.17 61.28,2.54 | v62.39,42.86 62.39,43.34 62.19,43.54 X1.6
  Top 0.406: C9.- 60.52,67.18 56.52,64.14 v53.34,64.14
  Top 0.813: J2.1 69.09,20.19 v69.06,20.16 | J1.1 69.09,9.4 v69.06,9.05 64.77,9.05 64.77,9.37 C7.2 64.42,10.93 C8.C 65.23,13.83 D7.A
  Top 1.778: Q4.3 32.03,45.44 v30.48,46.99 | Q6.3 18.06,45.44 v16.51,46.99 | C22.- 19.88,70.04 v17.78,67.94 | C18.- 33.84,70.04 v31.75,67.63 | Q8.3 5.36,48.93 v5.4,48.9 | v7.3,67.94 9.21,69.85 9.97,69.85 C26.-
  Bottom 0.254: C23.C 18.41,25.53 C24.2 v20.32,27.3 | C19.C 32.38,25.53 C20.2 35.72,27.3 36.35,27.94 v42.23,27.94 | v8.89,27.3 8.89,31.75 7.94,32.7 U6.9 | v22.86,27.3 22.86,31.43 21.91,32.7 U5.9 | v17.78,55.24 16.51,55.24 | C17.2 40.01,6.03 J3.1 40.01,14.61 40.64,15.24 42.23,15.24 44.45,17.46 | 44.45,17.46 44.45,19.41 U3.3 | C13.2 44.77,17.46 44.45,17.46 | v53.66,28.26 53.98,28.57 C1.2 50.16,29.85 49.21,30.8 49.21,34.92 49.53,35.24 49.53,36.99 50.01,37.47 51.12,37.47 52.07,36.51 v53.34,36.51 v55.56,36.51 | v42.23,31.11 42.23,32.7 | 42.23,32.7 U4.9 | v47.15,39.21 42.23,34.29 42.23,32.7
  Bottom 0.305: v62.39,42.86 62.39,41.75 C2.2
  Bottom 0.406: v53.34,64.14 51.44,64.14 49.85,62.55 C11.C | 53.49,64.28 v53.34,64.14 | C14.2 22.54,12.71 X3.P6 | IC2.3 56.83,61.91 56.2,62.55 55.71,62.55 D3.2 55.56,63.5 54.93,64.14 v53.34,64.14
  Bottom 0.813: v69.06,20.16 v69.06,9.05
  Bottom 1.778: v17.78,67.94 16.51,66.67 16.51,55.24 v16.51,46.99 | v31.75,67.63 30.48,66.04 v30.48,46.99 | v5.4,48.9 7.3,51.12 v7.3,67.94
  other vias: 2.54,11.43 63.66,72.07 56.67,45.88
  pour Bottom (isolate 0.406): 75,75 75,0 0,0 0,75
  pour Top (isolate 0.406, rank 2): 0,0 0,75 75,75 75,0
HALL_1  (via drill 0.61)
  Top 0.254: X3.P1 27.89,8.52 32.97,8.52 38.1,13.97 42.23,13.97 42.86,13.34 48.42,13.34 49.37,14.29 49.37,17.78 49.85,18.26 v50.64,18.26 | v61.59,26.35 61.59,30.96 59.85,32.7 57.09,32.7 IC1.15
  Bottom 0.254: v50.64,18.26 50.64,19.21 52.39,21.27 58.9,21.27 61.59,23.97 v61.59,26.35
HALL_2  (via drill 0.61)
  Top 0.254: v49.37,19.53 48.26,18.41 48.26,14.61 47.62,13.97 43.5,13.97 42.55,14.76 37.62,14.76 33.02,10.16 24.77,10.16 23.69,9.09 X3.P2 | v60.33,27.3 60.33,29.21 58.42,31.11 57.08,31.11 IC1.13
  Bottom 0.254: v49.37,19.53 51.75,21.91 58.42,21.91 60.33,23.81 v60.33,27.3
HALL_3
  Top 0.254: X3.P5 29.42,13.86 33.18,17.46 40.96,17.46 42.55,19.05 42.55,25.4 43.18,26.04 43.18,32.86 47.94,37.47 50.96,37.47 51.51,36.92 IC1.22
HSSOURCE_1  (via drill 0.61)
  Top 0.254: 33.7,40.01 Q4.4 | Q4.4 34.92,37.51 v34.92,34.29 34.92,32.49 L2.1 | 40.38,42.96 Q4.4
  Top 1.778: Q3.3 40.38,42.96
  Bottom 0.254: U4.8 34.33,34.89 v34.92,34.29 | C21.2 v30.8,40 v30.8,40.01
  pour Top (isolate 0.406, no thermals): 29.21,46.35 29.21,20.32 42.55,20.32 42.55,46.35
HSSOURCE_2  (via drill 0.61)
  Top 0.254: v16.83,40.01 19.73,40.01 Q6.4 | 26.41,42.96 Q6.4 | Q6.4 21.59,35.24 20.95,34.61 v20.95,34.29 20.95,32.17 L3.1
  Top 1.778: Q5.3 26.41,42.96
  Bottom 0.254: C25.2 v16.83,40 v16.83,40.01 | U5.8 20.36,34.89 v20.95,34.29
  pour Top (isolate 0.406, no thermals): 15.24,20.32 15.24,46.35 28.26,46.35 28.26,20.32
HSSOURCE_3  (via drill 0.61)
  Top 0.254: 6.35,30.16 6.35,30.9 L4.1 6.99,32.8 v6.99,34.29 7.62,34.97 Q8.4 | v2.86,40.01 5.75,40.01 Q8.4 | 12.44,42.96 Q8.4
  Top 1.778: Q7.3 12.44,42.96
  Bottom 0.254: U6.8 6.31,34.89 v6.99,34.29 | C29.2 v2.86,40 v2.86,40.01
  pour Top (isolate 0.406, no thermals): 1.27,20.32 1.27,46.35 14.29,46.35 14.29,20.32
INDEX/
  Bottom 0.254: U3.10 45.74,12.72 45.72,12.7 46.35,12.06 46.99,12.06 47.62,11.43 J3.4
LED_RED  (via drill 0.61)
  Top 0.254: IC1.23 50.7,36.29 v50.48,36.51 | v59.85,34.61 60.96,34.61 62.23,33.34 R2.2
  Bottom 0.254: v50.48,36.51 50.48,34.13 50.01,33.66 50.01,32.38 50.48,31.91 51.59,31.91 53.82,34.29 59.53,34.29 v59.85,34.61
LED_YELLOW
  Top 0.254: R3.2 63.18,30.8 60.38,33.6 IC1.16
LFLAG/  (via drill 0.61)
  Top 0.254: IC1.32 48.41,27.46 48.26,27.3 46.04,27.3 44.45,25.72 44.45,17.62 v46.83,15.08
  Bottom 0.254: R8.2 48.43,13.59 U3.8 46.99,13.64 46.99,14.76 v46.83,15.08
MISO  (via drill 0.61)
  Top 0.254: v48.58,26.35 49.75,26.35 IC1.1 | v55.24,22.86 55.56,22.54 57.47,22.54 58.1,23.34 61.28,23.34 66.52,28.42 69.37,28.42 70.17,29.21 70.17,34.45 67.47,36.83
  Top 0.305: 67.47,36.83 67.47,38.42 66.36,39.53 v64.29,39.53 | v63.82,37.31 63.18,36.67 59.05,36.67 58.42,37.31 X1.1
  Bottom 0.254: U3.6 46.38,20.34 46.99,20.95 47.94,20.95 48.58,21.59 48.58,24.13 | 48.58,24.13 v48.58,26.35 | v55.24,22.86 52.07,22.86 50.8,24.13 48.58,24.13
  Bottom 0.305: v64.29,39.53 64.29,37.62 v63.82,37.31
MOSI  (via drill 0.61)
  Top 0.254: v49.53,23.18 50.7,24.35 IC1.2 50.7,32.77 v50.96,33.02 | v65.25,43.5 65.25,44.93 63.5,46.51 60.48,46.51
  Top 0.305: 60.48,46.51 59.69,45.72 X1.4
  Bottom 0.254: U3.7 48.01,19.43 49.53,21.27 v49.53,23.18 | v50.96,33.02 52.7,35.08 57.78,35.08 65.25,42.23 v65.25,43.5
N$1  (via drill 0.61)
  Top 0.406: L1.1 v53.34,61.91
  Bottom 0.406: v53.34,61.91 54.61,61.91 54.78,61.77 54.93,61.62 54.93,60.64 55.08,60.49 D3.1 56.66,60.49 56.83,60.33 58.07,60.33 IC2.2
N$2
  Top 0.254: R2.1 D1.C
N$3
  Top 0.254: R3.1 67.79,30.8 D2.C
N$4
  Top 0.813: J2.4 67.92,23.94 67.31,23.34 67.31,20.64 | 67.31,20.64 67.31,13.81 67.94,13.18 68.26,13.15 J1.4 | U$1.2 67.31,20.64
N$5  (via drill 0.61)
  Top 0.305: v52.55,5.08 53.18,4.45 U1.6 | J1.2 72.7,10.65 v72.71,10.64 | v72.71,21.43 J2.2
  Top 0.406: J1.2 67.63,10.65 v66.36,10.64
  Bottom 0.305: v52.55,5.08 60.8,5.08 64.77,9.05 R4.2 66.14,10.42 v66.36,10.64 | v72.71,10.64 v72.71,21.43
N$6  (via drill 0.61)
  Top 0.305: U1.7 v52.55,3.17 | J2.3 v68.75,22.69 v68.74,22.7
  Top 0.406: J1.3 67.47,11.91 v67.32,12.05 v67.31,12.05 v67.31,12.06
  Bottom 0.305: v52.55,3.17 60.8,3.17 67.63,10 67.63,11.59 67.31,11.91 v67.31,12.06 | R4.1 67.25,12.12 v67.31,12.06 | v68.74,22.7 67.31,21.27 v67.31,12.06
N$7  (via drill 0.61)
  Top 0.254: IC1.11 55.81,29.6 v55.56,29.84
  Bottom 0.254: 59.37,29.84 v55.56,29.84
  Bottom 0.406: C5.1 62.55,34.92 62.08,34.46 Q1.3 60.64,32.28 60.01,31.65 60.01,30.48 59.37,29.84
N$8
  Bottom 0.254: U5.6 18.4,36.2 | 18.4,36.2 C25.1 | D5.1 16.67,35.72 17.14,36.2 18.4,36.2
N$9  (via drill 0.61)
  Top 0.254: IC1.10 55.78,28.8 v55.56,28.57
  Bottom 0.254: 56.52,28.57 v55.56,28.57
  Bottom 0.406: C4.1 65.82,30.58 Q1.1 64.28,29.68 63.5,28.89 59.37,28.89 59.05,28.57 v55.56,28.57
N$10
  Bottom 0.254: U4.6 32.37,36.2 | 32.37,36.2 C21.1 | D4.1 30.64,35.72 31.11,36.2 32.37,36.2
N$11
  Bottom 0.254: R7.2 41.7,16.3 43.81,18.41 43.81,19.41 U3.2
  Bottom 0.406: R7.2 39.47,16.3 39.05,15.88 39.05,15.24 38.68,14.87 Q2.3 37.3,13.48 C16.1
N$12  (via drill 0.61)
  Top 0.254: v37.78,46.99 37.78,45.5 Q4.1
  Bottom 0.254: U4.4 31.63,30.52 31.59,30.48 30.16,30.48 29.84,30.8 29.84,41.43 35.56,46.99 v37.78,46.99
N$13  (via drill 0.61)
  Top 0.254: v35.88,45.72 35.88,48.48 Q3.1
  Bottom 0.254: U4.7 33.03,36.21 33.66,36.83 33.66,43.5 v35.88,45.72
N$14
  Bottom 0.254: R7.1 41.17,18 42.61,19.43 U3.1
  Bottom 0.406: R7.1 35.08,18 | 35.08,18 33.39,18 33.18,17.78 33.18,17.3 C15.1 | Q2.1 35.09,17.69 35.08,18
N$15
  Top 1.778: F1.2 X2.P1
N$16
  Top 0.254: U2.6 45.09,43.34 47.15,41.12 48.1,41.12 C12.1
N$17  (via drill 0.61)
  Top 0.254: v23.81,46.99 23.81,45.5 Q6.1
  Bottom 0.254: U5.4 16.23,30.52 15.88,30.8 15.88,41.27 21.59,46.99 v23.81,46.99
N$18  (via drill 0.61)
  Top 0.254: v21.91,45.72 21.91,48.48 Q5.1
  Bottom 0.254: U5.7 19.06,36.21 19.68,36.83 19.68,43.18 v21.91,45.72
N$19  (via drill 3.2 pad 5.08)
  other vias: 3,3
N$20
  Bottom 0.254: U6.6 4.43,36.2 | 4.43,36.2 4.43,38.09 C29.1 | D6.1 2.7,35.72 3.17,36.2 4.43,36.2
N$21  (via drill 0.61)
  Top 0.254: v9.84,46.99 9.84,45.5 Q8.1
  Bottom 0.254: U6.4 2.18,30.52 1.91,30.8 1.91,41.27 7.62,46.99 v9.84,46.99
N$22  (via drill 0.61)
  Top 0.254: v7.94,45.72 7.94,48.48 Q7.1
  Bottom 0.254: U6.7 5.09,36.21 5.71,36.83 5.71,43.5 v7.94,45.72
N$23  (via drill 3.2 pad 5.08)
  other vias: 72,3
N$24  (via drill 3.2 pad 5.08)
  other vias: 72,72
N$25  (via drill 3.2 pad 5.08)
  other vias: 3,72
N$26  (via drill 3.2 pad 5.08)
  other vias: 3,55
N$27  (via drill 3.2 pad 5.08)
  other vias: 43,40
PWM_H_1  (via drill 0.61)
  Top 0.254: IC1.29 44.85,30.4 v44.77,30.48
  Bottom 0.254: v44.77,30.48 43.81,30.48 43.18,29.84 35.24,29.84 34.61,30.48 33.71,30.48 U4.1
PWM_H_2  (via drill 0.61)
  Top 0.254: v44.77,27.94 44.77,28.89 45.4,29.53 48.34,29.53 IC1.30
  Bottom 0.254: U5.1 20.02,30.47 21.91,28.57 21.91,24.77 24.45,22.7 33.81,22.7 38.1,26.83 43.02,26.83 44.13,27.94 v44.77,27.94
PWM_H_3  (via drill 0.61)
  Top 0.254: IC1.8 55.51,26.41 55.56,26.35 v56.83,26.35
  Bottom 0.254: U6.1 5.71,30.48 6.04,30.49 6.35,30.16 7.94,28.57 7.94,24.77 11.59,21.43 34.61,21.43 38.42,25.08 44.61,25.08 47.78,27.94 50.48,27.94 51.91,26.35 v56.83,26.35
PWM_L_1  (via drill 0.61)
  Top 0.254: v45.4,31.75 46.04,31.11 48.33,31.11 IC1.28
  Bottom 0.254: U4.2 33.03,29.52 33.34,29.21 45.09,29.21 45.72,29.84 45.72,31.43 v45.4,31.75
PWM_L_2  (via drill 0.61)
  Top 0.254: IC1.27 47.06,32 v46.35,32.7
  Bottom 0.254: U5.2 19.06,29.2 19.37,28.89 20.64,28.89 21.27,28.26 21.27,24.45 23.81,22.07 34.13,22.07 38.1,25.88 44.29,25.88 45.72,27.3 45.72,29.05 46.35,29.69 v46.35,32.7
PWM_L_3  (via drill 0.61)
  Top 0.254: v46.35,25.08 v49.53,25.08 | v56.52,23.81 56.83,23.81 57.78,24.77 57.78,27.62 57.41,28 IC1.9
  Bottom 0.254: U6.2 5.09,29.52 5.08,29.5 5.4,29.21 5.71,28.89 6.67,28.89 7.3,28.26 7.3,24.45 10.95,20.8 34.92,20.8 36.67,22.38 45.24,22.38 46.35,23.5 v46.35,25.08 | v49.53,25.08 51.12,25.08 52.39,23.81 v56.52,23.81
RESET  (via drill 0.61)
  Top 0.254: C3.1 54.13,41.75 53.98,41.59 R1.1 54.19,40.32 52.39,40.32 52.23,40.48 v52.23,43.18 | IC1.31 47.05,28.8 v46.74,28.48
  Top 0.305: 54.19,40.32 55.72,40.32 56.83,41.43 60.64,41.43 60.96,41.12 X1.5
  Bottom 0.254: v52.23,43.18 52.23,42.39 51.91,42.07 47.31,37.15 47.31,29.05 v46.74,28.48
SCK  (via drill 0.61)
  Top 0.254: IC1.12 57.87,30.4 59.05,29.21 v59.05,24.92 61.59,24.92 65.88,29.21 68.9,29.21 69.37,29.69 69.37,33.97 66.67,36.51
  Top 0.305: 66.67,36.51 66.67,38.1 66.36,38.42 63.5,38.42 62.87,37.78 60.17,37.78 59.69,38.26 X1.3
  Bottom 0.254: U3.5 45.74,20.61 45.72,20.64 46.67,21.59 47.62,21.59 47.94,21.91 47.94,24.13 47.47,24.45 47.47,26.67 48.1,27.3 50.16,27.3 52.39,24.92 v59.05,24.92
SHUNT_FILT  (via drill 0.61)
  Top 0.254: IC1.18 54.7,36.1 54.61,36.2 54.61,37.31 v54.45,37.47 | v51.28,38.42 50.48,39.21 50.48,41.91 50.01,42.39 47.15,42.39 46.35,43.18 U2.7
  Bottom 0.254: v54.45,37.47 52.23,37.47 v51.28,38.42
SS/  (via drill 0.61)
  Top 0.254: v46.99,22.54 47.94,22.54 48.26,22.23 50.16,22.23 51.44,23.5 51.44,26.43 IC1.3
  Bottom 0.254: U3.4 45.09,20.95 46.67,22.54 v46.99,22.54
STANDBY  (via drill 0.61)
  Top 0.254: v48.58,36.35 48.58,33.76 IC1.25 47.37,33.6 46.99,33.97 45.72,33.97 43.81,32.07 43.81,24.45 43.5,24.13 v43.5,23.5 | 52.39,20.32 51.44,21.27 46.35,21.27 45.4,22.23 v45.4,23.97
  Top 0.305: U1.8 52.39,1.91 51.12,3.02 51.12,7.46 52.39,8.89 52.39,20.32
  Top 0.406: v60.33,55.88 58.1,55.88 55.88,53.66 55.88,50.64 55.56,50.16 55.56,46.67 54.93,46.04 v54.93,45.72
  Bottom 0.254: 54.93,43.81 48.58,37.15 v48.58,36.35 | v45.4,23.97 44.93,23.97 44.45,23.5 v43.5,23.5
  Bottom 0.406: IC2.5 59.78,65.32 60.33,64.77 v60.33,55.88 | 54.93,43.81 v54.93,45.72
TEMP  (via drill 0.61)
  Top 0.254: IC1.14 55.95,32 55.72,32.23 55.72,33.81 57.63,35.72
  Top 0.305: 57.63,35.72 61.75,35.72 61.91,35.56 64.77,35.56 65.41,36.2 v65.41,37.31
  Top 0.406: R6.1 v19.68,51.44 | v66.36,41.75 66.36,45.09 62.71,48.58 62.71,49.69 62.07,50.32 58.9,50.32 v57.15,52.23
  Bottom 0.254: v19.68,51.44 19.68,50.8 20.95,49.53 24.13,49.53 28.57,45.09 31.11,45.09 39.37,53.02 50.27,53.02 R5.1 50.32,52.49 50.32,51.59 50.8,50.96 53.82,50.96 55.09,52.23 v57.15,52.23 | v65.41,37.31 66.36,38.26 v66.36,41.75
VCC  (via drill 0.61)
  Top 0.254: U2.8 48.18,43.89 48.58,43.5 C10.1 | v41.91,12.7 49.53,12.7 50.16,12.06 J3.5 | 61.59,4.45 61.91,4.76 C6.1 | SJ1.2 52.23,52.55 v53.34,52.55 | D2.A D1.A 71.75,33.65 71.75,34.13 68.1,37.47 68.1,39.21 66.99,40.32 65.56,40.32 64.77,41.12 | v56.99,38.1 56.67,38.1 56.04,38.73 54.08,38.73 R1.2 | 52.3,39.13 52.23,39.21 | v54.45,33.18 54.29,33.18 53.74,33.73
  Top 0.305: 61.59,4.45 U1.3 | 64.77,41.12 63.66,42.23 v63.66,44.77 | v54.45,6.99 54.45,5.73 U1.5 | X1.2 v58.42,45.56
  Top 0.406: 52.3,33.66 IC1.21 52.3,38.73 | 52.3,33.66 IC1.4 52.3,25.16 52.7,24.77 52.7,21.27 v53.97,20.01 | IC1.19 53.91,33.9 53.74,33.73 53.66,33.66 52.3,33.66 | C10.1 50.8,43.5 | 50.8,43.5 50.8,42.39 51.28,41.91 51.28,40.16 52.23,39.21 | 52.3,38.73 53.98,38.73 R1.2 | 50.8,43.5 50.8,43.81 v52.23,45.24 | v47.94,51.91 51.75,51.91 52.23,52.55 52.23,55.21 SJ1.2 | 52.3,38.73 52.3,39.13 | C6.1 v64.14,4.45
  Top 0.813: U$1.1 60.81,20.32 D7.C 60.81,13.83 C8.A 61.62,10.61 C7.1 61.91,4.76
  Bottom 0.254: C17.1 48.9,6.35 50.16,7.62 | v41.91,12.7 42.8,13.59 U3.14 U3.13 43.81,13.61 43.81,15.24 44.45,16.04 48.26,16.03 48.58,15.56 C13.1 | v54.45,6.99 53.66,7.62 51.12,7.62 50.16,7.62 | 50.16,7.62 J3.5 50.16,12.06 50.38,12.28 R8.1 51.75,13.34 | v53.34,52.55 R5.2 | C2.1 60.01,39.69 58.42,38.1 v56.99,38.1 | C1.1 53.98,32.7 v54.45,33.18
  Bottom 0.305: C13.1 51.28,15.56 53.98,18.26 53.98,20.32 v53.97,20.01 | v58.42,45.56 59.85,45.56 | 59.85,45.56 62.87,45.56 v63.66,44.77 | C2.1 60.01,45.41 59.85,45.56
  Bottom 0.406: C14.1 20.64,9.51 X3.P3 19.49,3.05 22.07,0.95 40.96,0.95 41.91,1.9 C17.1 | v52.23,45.24 52.23,47.31 48.74,50.96 v47.94,51.91 | v64.14,4.45 61.75,2.06 51.59,2.06 51.28,2.38 51.28,7.46 51.12,7.62
VDD  (via drill 0.61)
  Top 0.406: C9.+ 67.12,59.18 66.67,59.05 59.37,59.05 v56.83,56.52 54.93,54.61 54.93,51.28 54.29,50.32 54.14,50.17 F1.1
  Bottom 0.61: IC2.1 58.19,57.86 v56.83,56.52
  pour Top (no thermals): 46.35,50.8 54.61,50.8 54.61,46.99 46.35,46.99
VDD_HS
  pour Top (isolate 0.406, no thermals): 1.27,47.31 1.27,66.04 45.09,66.04 45.09,47.31
WINDING_1
  Top 1.778: X3.P7 19.49,15.52 20.8,16.83 27.78,16.83 31.75,20.8 35.14,20.8 L2.2
WINDING_2
  Top 1.778: L3.2 17.2,20.85 15.29,19.1 X3.P8
WINDING_3
  Top 1.778: L4.2 7.62,12.86 12.12,8.36 X3.P4

### Text on the board
Bottom: Weklin MotorBoard v2